# Altium schematic sheet Adc.SchDoc
size 420 x 297 mm; DocumentNumber: Audio output
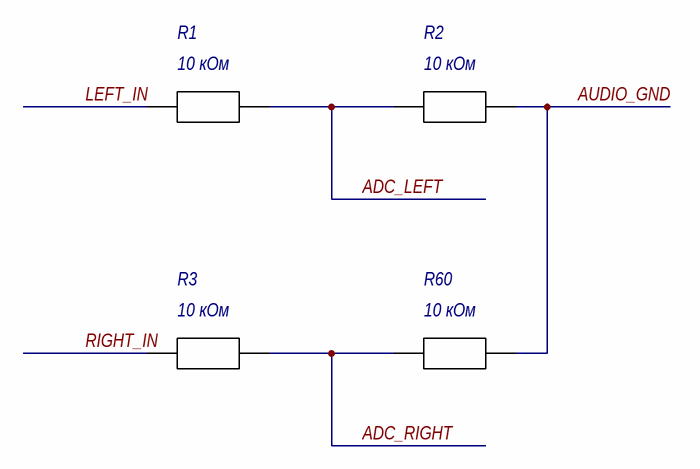
[diagram p0: Adc.SchDoc]

## Parts
R1  10 кОм  [RES 0805]
R2  10 кОм  [RES 0805]
R3  10 кОм  [RES 0805]
R60  10 кОм  [RES 0805]

## Nets
ADC_LEFT: R1.1 R2.2
ADC_RIGHT: R3.1 R60.2
AUDIO_GND: R2.1 R60.1
LEFT_IN: R1.2
RIGHT_IN: R3.2

## Notes on the sheet
- Подп. и дата
- Инв. № дубл.
- Взам. инв. №
- Инв. № подл.
- Лист
- Изм.
- № докум.
- Подп.
- Дата
- Копировал
- Формат А3

## Library data of the parts
R1-R3 R60 = RES 0805